# EAGLE design Adafruit VCNL4010 (EAGLE 6.6.0)
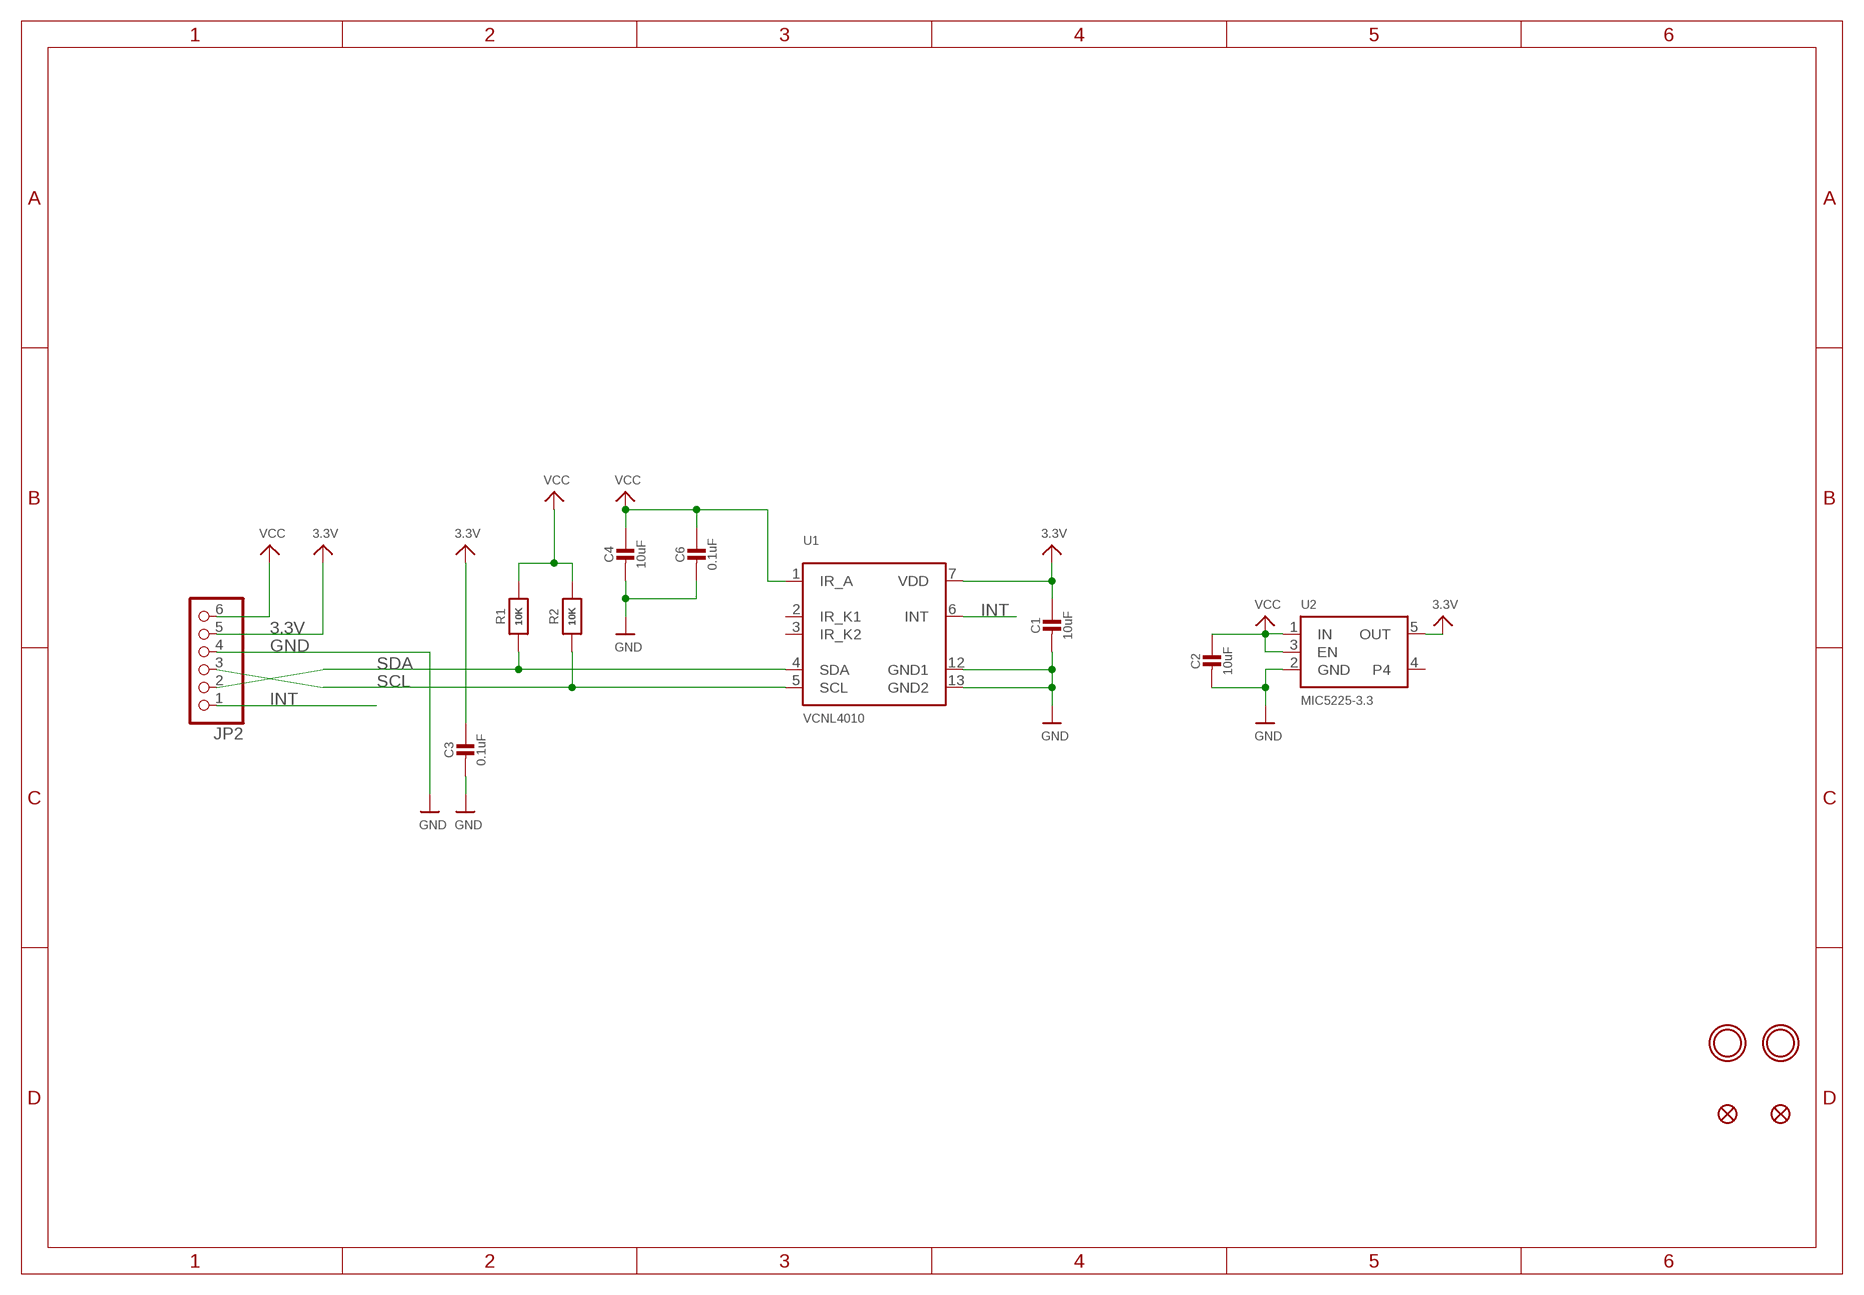
[diagram p0: schematic, sheet 1]

## Parts
C1  10uF  CAP_CERAMIC0805-NOOUTLINE  [0805-NO]
C2  10uF  CAP_CERAMIC0805-NOOUTLINE  [0805-NO]
C3  0.1uF  CAP_CERAMIC0805-NOOUTLINE  [0805-NO]
C4  10uF  CAP_CERAMIC0805-NOOUTLINE  [0805-NO]
C6  0.1uF  CAP_CERAMIC0805-NOOUTLINE  [0805-NO]
JP2  HEADER-1X676MIL  [1X06_ROUND_76]
R1  10K  RESISTOR0805_NOOUTLINE  [0805-NO]
R2  10K  RESISTOR0805_NOOUTLINE  [0805-NO]
U1  VCNL4010  [VCNL4010]
U2  MIC5225-3.3  VREG_SOT23-5  [SOT23-5]
U$5  MOUNTINGHOLE2.5  [MOUNTINGHOLE_2.5_PLATED]
U$6  MOUNTINGHOLE2.5  [MOUNTINGHOLE_2.5_PLATED]
U$7  FIDUCIAL""  [FIDUCIAL_1MM]
U$8  FIDUCIAL""  [FIDUCIAL_1MM]

## Nets
3.3V: C1.1 C3.1 JP2.5 U1.7(VDD) U2.5(OUT)
GND: C1.2 C2.2 C3.2 C4.2 C6.2 JP2.4 U1.12(GND1) U1.13(GND2) U2.2(GND)
INT: JP2.1 U1.6(INT)
SCL: JP2.3 R2.1 U1.5(SCL)
SDA: JP2.2 R1.1 U1.4(SDA)
VIN: C2.1 C4.1 C6.1 JP2.6 R1.2 R2.2 U1.1(IR_A) U2.1(IN) U2.3(EN) ; supply symbol labelled VCC
Unconnected: U1.2(IR_K1) U1.3(IR_K2) U2.4

## Library data of the parts
C1-C4 C6 = microbuilder:CAP_CERAMIC: Ceramic Capacitors For new designs, use the packages preceded by an '_' character since they are more reliable: The following footprints should be used on most boards: _0402 - Standard footprint for regular board layouts _0603 - Standard footprint for regular board layouts _0805 - Standard footprint for regular board layouts _1206 - Standard footprint for regular board layouts For extremely tight-pitch boards where space is at a premium, the following 'micro-pitch' footprints can be used (smaller pads, no silkscreen outline, etc.): _0402MP - Micro-pitch footprint for very dense/compact boards _0603MP - Micro-pitch footprint for very dense/compact boards _0805MP - Micro-pitch footprint for very dense/compact boards _1206MP - Micro-pitch footprint for very dense/compact boards
JP2 = microbuilder:HEADER-1X6: PIN HEADER
R1 R2 = microbuilder:RESISTOR: Resistors For new designs, use the packages preceded by an '_' character since they are more reliable: The following footprints should be used on most boards: _0402 - Standard footprint for regular board layouts _0603 - Standard footprint for regular board layouts _0805 - Standard footprint for regular board layouts _1206 - Standard footprint for regular board layouts For extremely tight-pitch boards where space is at a premium, the following 'micro-pitch' footprints can be used (smaller pads, no silkscreen outline, etc.): _0402MP - Micro-pitch footprint for very dense/compact boards _0603MP - Micro-pitch footprint for very dense/compact boards _0805MP - Micro-pitch footprint for very dense/compact boards _1206MP - Micro-pitch footprint for very dense/compact boards
U1 = microbuilder:VCNL4010: VCNL4010 - I²C Proximity and Light Sensor Supply: 2.5-3.6V Proximity: up to 200mm Luminosity: 0.25 to 16,000 lux (16-bit values)
U2 = microbuilder:VREG_SOT23-5: SOT23-5 Fixed Voltage Regulators Part Current Out V Out V In V Dropout θJA (°C/W) TJ (°C) Digikey Part No. ADP121 150mA 3.3V 3.4-5.5V 0.09V @ 150mA -- -- ADP121-AUJZ33R7CT-ND ADP121 150mA 3.0V 3.1-5.5V 0.09V @ 150mA -- -- ADP121-AUJZ30R7CT-ND ADP122 300mA 3.3V 3.4-5.5V 0.085V @ 300mA -- -- ADP122AUJZ-3.3-R7CT-ND ADP1712 300mA 3.3V 3.5-5.5V 0.17V @ 300mA -- -- ADP1712AUJZ-3.3-R7TR-ND AP7311 (Low Cost) 150mA 3.3V 3.5-6V 0.15V @ 150mA -- -- AP7311-33WG-7DICT-ND LD39015M18R 150mA 1.8V 1.9V-5.5V 0.08V @ 100mA -- -- 497-6977-1-ND LP2985A-33DBVR 150mA 3.3V 3.3-16V 0.28V @ 150mA 206 150 296-18479-1-ND MCP1824T-3302E/OT 300mA 3.3V 3.5V-6V 0.2V @ 300mA -- -- MCP1824T-3302E/OTCT-ND MIC5205-2.5YM5 TR 150mA 2.5V 2.7-16V 0.165V @ 150mA -- -- 576-1257-2-ND MIC5205-3.0YM5 TR 150mA 3.0V 3.2V-16V 0.165V @ 150mA -- -- 576-1258-2-ND MIC5205-3.3YM5 TR 150mA 3.3V 3.5V-16V 0.165V @ 150mA -- -- 576-1259-2-ND TPS780330220 150mA 3.3V+2.2V 3.6-5.5V 250mV Max -- -- 296-23332-1-ND TDA3663/N1,135 100mA 3.3V 3.5-45V 0.18V @ 50mA -- -- 568-5343-1-ND Max operating temp can be calculated using θJA, TJ (max junction temperature), and power in watts. Set the "Maximum Ambient Temperature" until it reaches TJ ("Max Junction Temperature"), which is the absolute limit for safe use of the regulator: Heat Sink Temperature Calculator <http://www.daycounter.com/Calculators/Heat-Sink-Temperature-Calculator.phtml> For example, With 12V source into a 3.3V LP2985 and a 30mA load, we are dissipating (12V-3.3V) * 0.03A = 0.261W. With a θJA of 206 °C/W, a TJ of 150°C, and 261mW we can safely use the chip without a heat sink up to 75°C (=147.1°C Junction Temperature).
U$5 U$6 = microbuilder:MOUNTINGHOLE: Mounting Hole For #2 screws (0.086"/2.18mm width, 0.094"/2.4mm hole) use 2.5mm; BOM: EXCLUDE
U$7 U$8 = microbuilder:FIDUCIAL: Fiducial Alignment Points Various fiducial points for machine vision alignment.; BOM: EXCLUDE

## Board
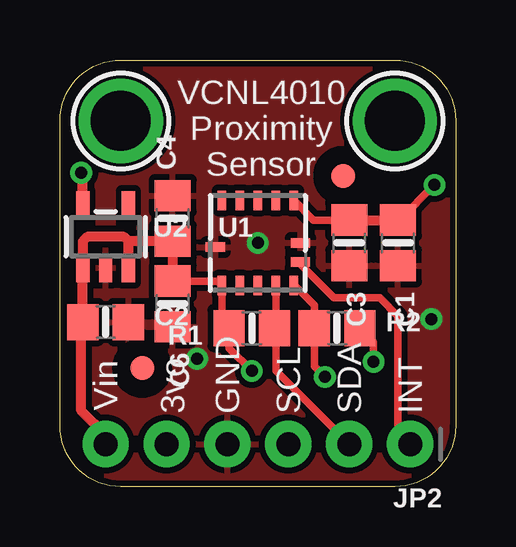
[diagram p1: board, top side]
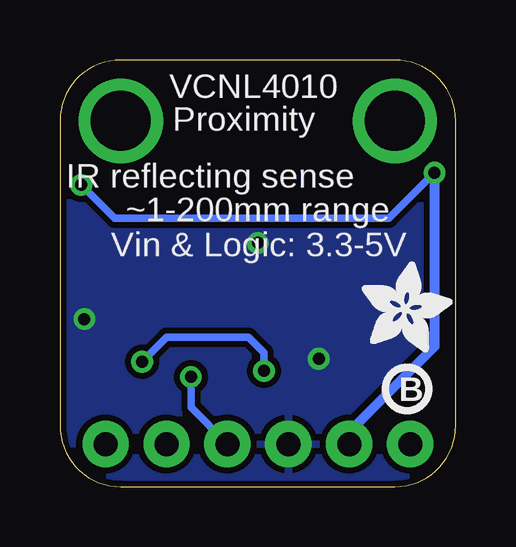
[diagram p2: board, bottom side, seen from below]

Size 16.51 x 17.78 mm. Coordinates in mm from the lower left corner, seen from the top.
Outline: 13.97,0 2.54,0 arc-90 0,2.54 0,15.24 arc-90 2.54,17.78 13.97,17.78 arc-90 16.51,15.24 16.51,2.54 arc-90 13.97,0
Copper layers (1*16): Top 0.035mm / dielectric 1.5mm / Bottom 0.035mm
Design rules "adafruit *": minimum track width 8mil, minimum drill 15.5mil, track to track 8mil, track to pad 8mil, pad to pad 8mil, via to via 8mil, smd to smd 8mil, copper to edge 10mil, drill to drill 8mil, minimum pad ring 10mil, minimum via ring 8mil, stop-mask expansion 2mil, vias tented up to drill 20mil, thermal gap 10mil

### Footprints (pad centres in the part's own frame; a part is rotated, then mirrored left to right if it is on the bottom)
0805-NO = smd 1.3 x 1.5: 1 -0.95,0; 2 0.95,0
1X06_ROUND_76 = drill 1 pad 1.93: 1 -6.35,0; 2 -3.81,0; 3 -1.27,0; 4 1.27,0; 5 3.81,0; 6 6.35,0
VCNL4010 = smd 0.35 x 0.805: 1 -1.5,-1.772; 2 -0.75,-1.772; 3 0,-1.772; 4 0.75,-1.772; 5 1.5,-1.772; 7 1.5,1.772; 8 0.75,1.772; 9 0,1.772; 10 -0.75,1.772; 11 -1.5,1.772 | smd 0.805 x 0.4: 6 1.772,-0.8; 12 -1.772,-0.175; 13 1.772,0
SOT23-5 = smd 0.55 x 1.2: 1 -0.95,-1.3; 2 0,-1.3; 3 0.95,-1.3; 4 0.95,1.3; 5 -0.95,1.3
MOUNTINGHOLE_2.5_PLATED = drill 2.5 pad 3.2: P$1 0,0
FIDUCIAL_1MM = smd 1 x 1: 1 0,0

### Placement (x,y rotation side)
C1  14.1,10.16 270 top
C2  1.91,6.86 0 top
C3  12.06,10.16 270 top
C4  4.7,11.18 90 top
C6  4.7,7.62 270 top
JP2  8.26,1.78 180 top
R1  8,6.6 180 top
R2  11.56,6.6 0 top
U1  8.26,10.16 0 top
U2  1.91,10.41 0 top
U$5  2.54,15.24 0 top
U$6  13.97,15.24 0 top
U$7  3.43,4.95 0 top
U$8  11.81,12.95 0 top
U$13  [PCBFEAT-REV-040]  2.03,4.06 0 bottom
U$14  [ADAFRUIT_3.5MM]  3.94,5.59 0 bottom

### Tracks (layer width: path | path; a pad name or v marks a point on that pad's centre or on a via)
3.3V  (via drill 0.5)
  Top 0.305: U1.7 10.58,11.11 C3.1 | C1.1 14.16,11.11 v15.62,12.57
  Top 0.406: C3.1 C1.1 | U2.5 0.95,13.02 v0.89,13.08
  Bottom 0.305: v15.62,12.57 14.22,11.18 2.79,11.18 v0.89,13.08 | 4.45,1.84 JP2.5
  Bottom 0.406: v0.89,13.08 0.89,5.84 4.45,2.29 JP2.5
GND  (via drill 0.5)
  other vias: 5.71,5.33 15.49,6.99 8.26,10.16
  pour Top (isolate 0.254): -0.13,17.79 16.9,17.92 16.78,0 -0.13,0
  pour Bottom (isolate 0.254): -0.13,17.91 17.02,18.03 16.89,0.13 -0.13,0
INT
  Top 0.305: U1.6 10.03,9.28 11.43,7.87 13.34,7.87 14.1,7.11 14.1,2.29 JP2.1
SCL  (via drill 0.5)
  Top 0.305: U1.5 9.77,8.39 10.61,7.55 R2.1 10.61,5.01 v11.05,4.57
  Bottom 0.305: v11.05,4.57 11.05,3.3 JP2.3
SDA
  Top 0.305: U1.4 9.01,6.6 | 9.01,6.6 R1.1 | 9.01,6.6 9.01,4.84 JP2.2
VIN  (via drill 0.5)
  Top 0.305: C6.1 6.57,8.57 U1.1 6.75,6.9 R1.2 7.05,5.78 v8,4.83 | R2.2 13.08,6.03 v13.08,5.21
  Top 0.406: JP2.6 1.91,2.16 0.89,3.17 0.89,6.79 C2.1 U2.1 0.95,10.23 1.14,10.41 2.67,10.41 2.85,10.23 | U2.3 2.85,10.23 | 2.85,10.23 C4.1 C6.1
  Bottom 0.305: v13.08,5.21 12.06,6.22 8.64,6.22 8,5.59 v8,4.83

### Text on the board
tPlace: VCNL4010 | Proximity | Sensor | Vin | 3vo | GND | SCL | SDA | INT
bPlace: VCNL4010 | Proximity | ~1-200mm range | IR reflecting sense | Vin & Logic: 3.3-5V